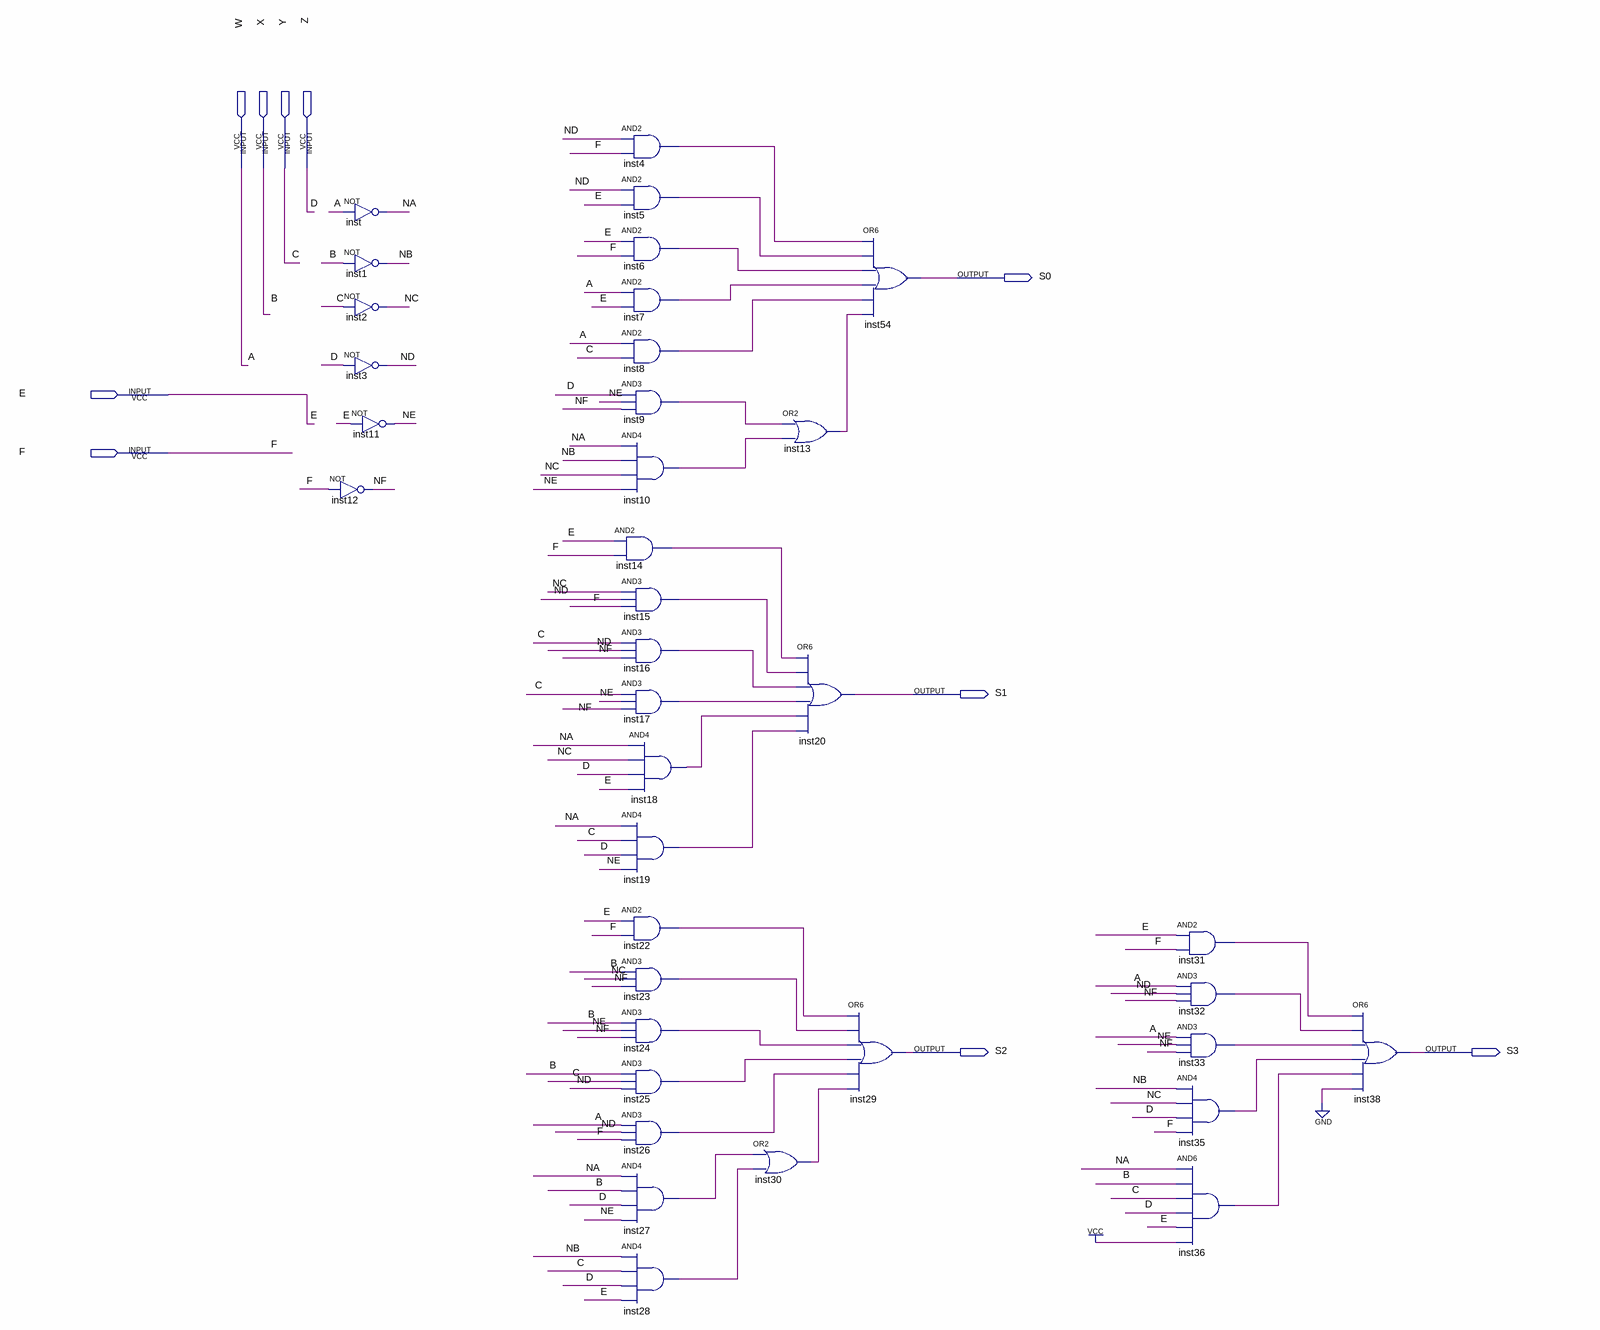
[diagram p0: schematic sheet]
// Quartus schematic entrada.bdf as structural Verilog: 37 symbols, 10 pins
module entrada (
  input  W,
  input  X,
  input  Y,
  input  Z,
  input  E,
  input  F,
  output S0,
  output S1,
  output S2,
  output S3
);

  wire inst4_out, inst5_out, inst6_out, inst7_out, inst8_out, inst9_out, inst10_out, inst13_out, inst14_out,
       inst15_out, inst16_out, inst17_out, inst18_out, inst19_out, inst22_out, inst23_out, inst24_out,
       inst25_out, inst26_out, inst27_out, inst28_out, inst30_out, inst31_out, inst32_out, inst33_out,
       inst35_out, inst36_out, NA, NB, NC, ND, NE, NF;

  not inst12 (NF, F);
  not inst (NA, W);
  not inst1 (NB, X);
  not inst2 (NC, Y);
  not inst3 (ND, Z);
  not inst11 (NE, E);
  and inst4 (inst4_out, ND, F);
  and inst5 (inst5_out, ND, E);
  and inst6 (inst6_out, E, F);
  and inst7 (inst7_out, W, E);
  and inst8 (inst8_out, W, Y);
  and inst9 (inst9_out, Z, NE, NF);
  and inst10 (inst10_out, NA, NB, NC, NE);
  and inst14 (inst14_out, E, F);
  and inst15 (inst15_out, NC, ND, F);
  and inst16 (inst16_out, Y, ND, NF);
  and inst17 (inst17_out, Y, NE, NF);
  and inst19 (inst19_out, NA, Y, Z, NE);
  and inst22 (inst22_out, E, F);
  and inst23 (inst23_out, X, NC, NF);
  and inst24 (inst24_out, X, NE, NF);
  and inst25 (inst25_out, X, Y, ND);
  and inst26 (inst26_out, W, ND, F);
  and inst27 (inst27_out, NA, X, Z, NE);
  and inst28 (inst28_out, NB, Y, Z, E);
  and inst18 (inst18_out, NA, NC, Z, E);
  or inst13 (inst13_out, inst9_out, inst10_out);
  or inst20 (S1, inst14_out, inst15_out, inst16_out, inst17_out, inst18_out, inst19_out);
  or inst30 (inst30_out, inst27_out, inst28_out);
  or inst29 (S2, inst22_out, inst23_out, inst24_out, inst25_out, inst26_out, inst30_out);
  or inst54 (S0, inst4_out, inst5_out, inst6_out, inst7_out, inst8_out, inst13_out);
  and inst31 (inst31_out, E, F);
  and inst32 (inst32_out, W, ND, NF);
  and inst33 (inst33_out, W, NE, NF);
  and inst35 (inst35_out, NB, NC, Z, F);
  and inst36 (inst36_out, NA, X, Y, Z, E, 1'b1);
  or inst38 (S3, inst31_out, inst32_out, inst33_out, inst35_out, inst36_out, 1'b0);

  // Other names for the same wires on the sheet: A = W; B = X; C = Y; D = Z
endmodule
